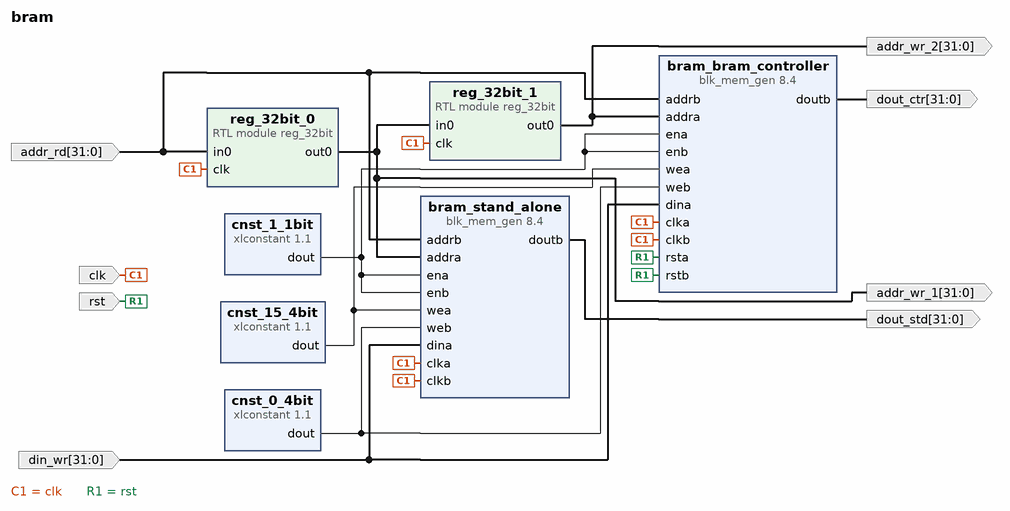
[diagram p0: block diagram of the top level]
# Vivado block design bram, xc7z020clg400-1, Vivado 2021.1
create_bd_design bram

create_bd_port -dir I -type clk clk
create_bd_port -dir I -from 31 -to 0 addr_rd
create_bd_port -dir O -from 31 -to 0 dout_std
create_bd_port -dir I -from 31 -to 0 din_wr
create_bd_port -dir O -from 31 -to 0 dout_ctr
create_bd_port -dir I -type rst rst
create_bd_port -dir O -from 31 -to 0 addr_wr_1
create_bd_port -dir O -from 31 -to 0 addr_wr_2

create_bd_cell -type ip -vlnv xilinx.com:ip:blk_mem_gen:8.4 bram_stand_alone
set_property -dict [list \
  CONFIG.EN_SAFETY_CKT true \
  CONFIG.Enable_32bit_Address true \
  CONFIG.Enable_B Use_ENB_Pin \
  CONFIG.Memory_Type True_Dual_Port_RAM \
  CONFIG.Port_A_Write_Rate 50 \
  CONFIG.Port_B_Clock 100 \
  CONFIG.Port_B_Enable_Rate 100 \
  CONFIG.Port_B_Write_Rate 50 \
  CONFIG.Read_Width_A 32 \
  CONFIG.Read_Width_B 32 \
  CONFIG.Register_PortA_Output_of_Memory_Core false \
  CONFIG.Register_PortA_Output_of_Memory_Primitives false \
  CONFIG.Register_PortB_Output_of_Memory_Core false \
  CONFIG.Register_PortB_Output_of_Memory_Primitives false \
  CONFIG.Use_RSTA_Pin true \
  CONFIG.Use_RSTB_Pin true \
  CONFIG.Write_Depth_A 2048 \
  CONFIG.Write_Width_A 32 \
  CONFIG.Write_Width_B 32 \
  CONFIG.use_bram_block Stand_Alone \
] [get_bd_cells bram_stand_alone]
create_bd_cell -type ip -vlnv xilinx.com:ip:xlconstant:1.1 cnst_1_1bit
create_bd_cell -type ip -vlnv xilinx.com:ip:xlconstant:1.1 cnst_15_4bit
set_property -dict {CONFIG.CONST_VAL 15 CONFIG.CONST_WIDTH 4} [get_bd_cells cnst_15_4bit]
create_bd_cell -type ip -vlnv xilinx.com:ip:xlconstant:1.1 cnst_0_4bit
set_property -dict {CONFIG.CONST_VAL 0 CONFIG.CONST_WIDTH 4} [get_bd_cells cnst_0_4bit]
create_bd_cell -type ip -vlnv xilinx.com:ip:blk_mem_gen:8.4 bram_bram_controller
set_property -dict [list \
  CONFIG.Enable_B Use_ENB_Pin \
  CONFIG.Memory_Type True_Dual_Port_RAM \
  CONFIG.Port_B_Clock 100 \
  CONFIG.Port_B_Enable_Rate 100 \
  CONFIG.Port_B_Write_Rate 50 \
  CONFIG.Use_RSTB_Pin true \
] [get_bd_cells bram_bram_controller]
create_bd_cell -type module -reference reg_32bit reg_32bit_0
create_bd_cell -type module -reference reg_32bit reg_32bit_1

# ---- connections ----

connect_bd_net -net addrb_0_1 [get_bd_ports addr_rd] \
  [get_bd_pins bram_stand_alone/addrb] [get_bd_pins bram_bram_controller/addrb] [get_bd_pins reg_32bit_0/in0]
connect_bd_net -net blk_mem_gen_0_doutb [get_bd_pins bram_stand_alone/doutb] [get_bd_ports dout_std]
connect_bd_net -net blk_mem_gen_1_doutb [get_bd_pins bram_bram_controller/doutb] [get_bd_ports dout_ctr]
connect_bd_net -net clka_0_1 [get_bd_ports clk] \
  [get_bd_pins bram_stand_alone/clka] [get_bd_pins bram_stand_alone/clkb] [get_bd_pins bram_bram_controller/clka] \
  [get_bd_pins bram_bram_controller/clkb] [get_bd_pins reg_32bit_0/clk] [get_bd_pins reg_32bit_1/clk]
connect_bd_net -net dina_0_1 [get_bd_ports din_wr] [get_bd_pins bram_stand_alone/dina] [get_bd_pins bram_bram_controller/dina]
connect_bd_net [get_bd_pins reg_32bit_0/out0] [get_bd_pins bram_stand_alone/addra] [get_bd_ports addr_wr_1] [get_bd_pins reg_32bit_1/in0]
connect_bd_net [get_bd_pins reg_32bit_1/out0] [get_bd_pins bram_bram_controller/addra] [get_bd_ports addr_wr_2]
connect_bd_net -net rsta_0_1 [get_bd_ports rst] [get_bd_pins bram_bram_controller/rsta] [get_bd_pins bram_bram_controller/rstb]
connect_bd_net -net xlconstant_0_dout [get_bd_pins cnst_1_1bit/dout] \
  [get_bd_pins bram_stand_alone/ena] [get_bd_pins bram_stand_alone/enb] [get_bd_pins bram_bram_controller/ena] \
  [get_bd_pins bram_bram_controller/enb]
connect_bd_net -net xlconstant_1_dout [get_bd_pins cnst_15_4bit/dout] [get_bd_pins bram_stand_alone/wea] [get_bd_pins bram_bram_controller/wea]
connect_bd_net -net xlconstant_2_dout [get_bd_pins cnst_0_4bit/dout] [get_bd_pins bram_stand_alone/web] [get_bd_pins bram_bram_controller/web]

validate_bd_design
save_bd_design
